# Altium schematic sheet DDS.SchDoc (part 3 of 3)
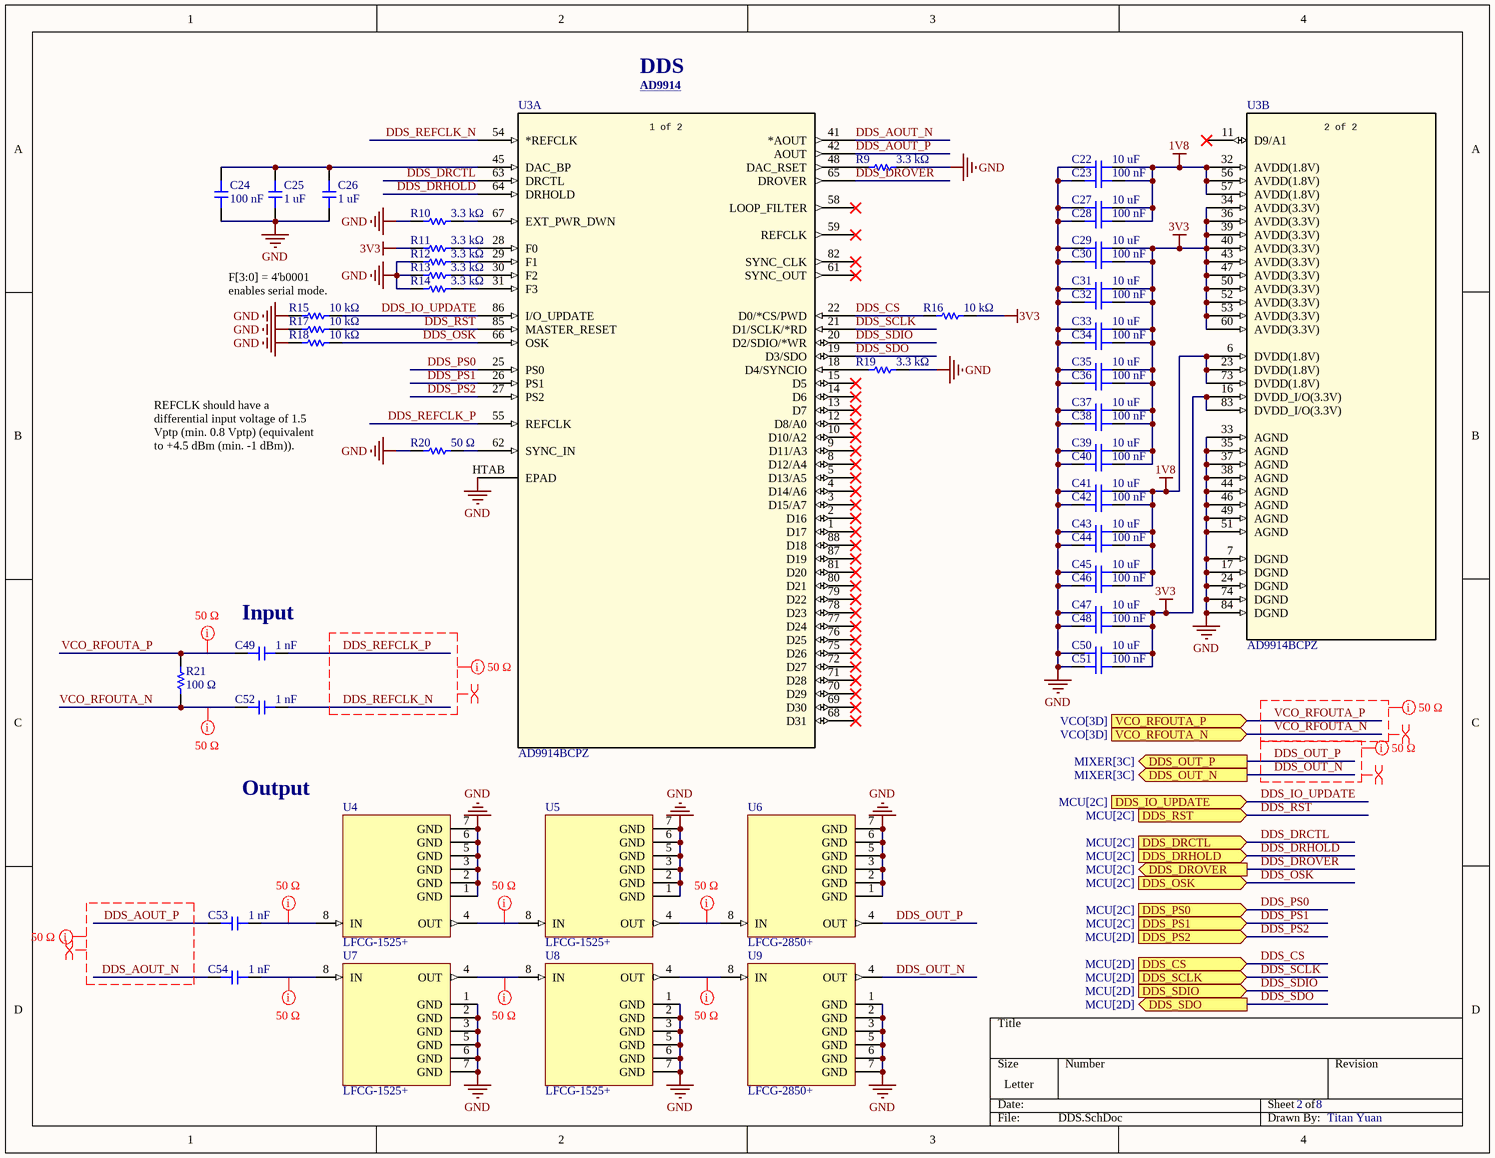
[diagram p2: DDS.SchDoc]

## Library data of the parts (continued)
U6 U9 = LFCG-2850+: 1.8dB 50Ω 2.85GHz 0805 SMD mount 2mm*1.25mm*950μm; Manufacturer: Mini-Circuits; Cutoff Frequency: 3.25GHz; Manufacturer Part Number: LFCG-2850+; Supplier: DigiKey; Supplier Part Number: 3157-LFCG-2850+CT-ND; RoHS: Compliant; Category: Ceramic Filters; Stock: 1260; Pricing: 1=14.41, 20=7.032, 50=6.744, 100=6.3, 200=5.724, 500=5.136 (USD); Export Control Classification Number (ECCN) Code: EAR99; Height: 950µm; Insertion Loss (dB): 1.8dB; Introduction Date: 2018-10-03; Length: 2mm; Lifecycle Status: Production; Max Operating Temperature: 85°C; Min Operating Temperature: -40°C; Mounting Technology: Surface Mount; REACH SVHC: Yes; Width: 1.25mm; ComponentLink1URL: https://datasheet.octopart.com:443/LFCG-2850%2B-Mini-Circuits-datasheet-180701242.pdf?src-supplier=IHS; ComponentLink1Description: https://datasheet.octopart.com:443/LFCG-2850%2B-Mini-Circuits-datasheet-180701242.pdf?src-supplier=IHS